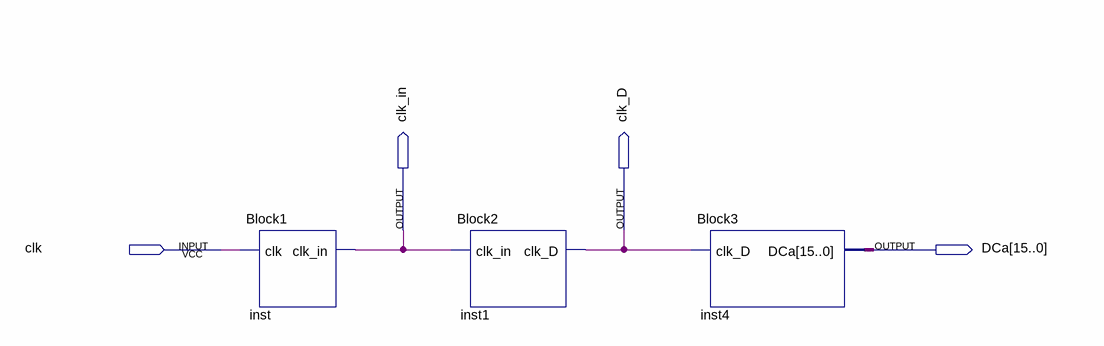
[diagram p0: schematic sheet]
// Quartus schematic lab2.bdf as structural Verilog: 3 symbols, 4 pins
module lab2 (
  input  clk,
  output clk_in,
  output clk_D,
  output [15:0] DCa
);

  Block1 inst (.clk(clk), .clk_in(clk_in));
  Block2 inst1 (.clk_in(clk_in), .clk_D(clk_D));
  Block3 inst4 (.clk_D(clk_D), .DCa(DCa));
endmodule
